# Altium schematic sheet Microcontroller.SchDoc
size A4; SheetNumber: 3; SheetTotal: 3
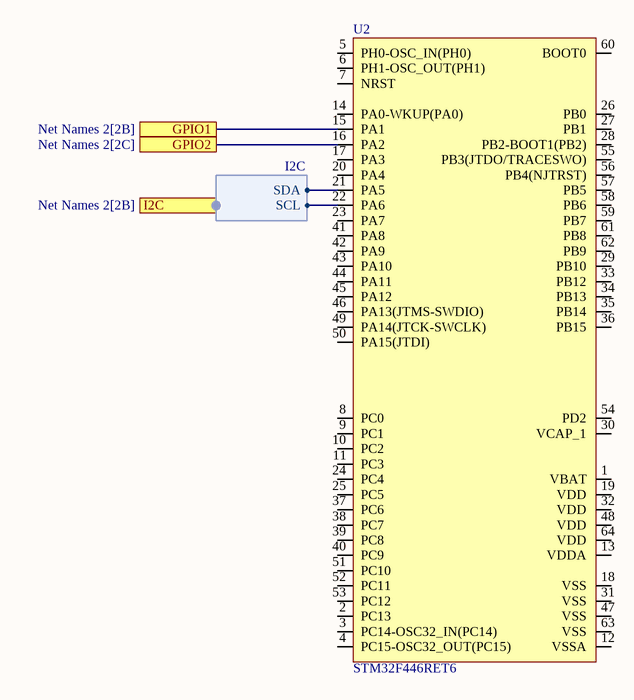
[diagram p0: Microcontroller.SchDoc]

## Parts
U2  STM32F446RET6  [STM_LQFP64_N]

## Ports
GPIO1 (see Net Names 2[2B]), GPIO2 (see Net Names 2[2C]), I2C (harness I2C, see Net Names 2[2B])

## Harnesses
I2C: SDA, SCL

## Nets
GPIO1: U2.15(PA1) ; port GPIO1
GPIO2: U2.16(PA2) ; port GPIO2
NetU2_21: U2.21(PA5) ; port I2C.SDA
NetU2_22: U2.22(PA6) ; port I2C.SCL

Not connected (* = marked no-connect by the designer): U2 1(VBAT) 2(PC13) 3(PC14-OSC32_IN(PC14)) 4(PC15-OSC32_OUT(PC15)) 5(PH0-OSC_IN(PH0)) 6(PH1-OSC_OUT(PH1)) 7(NRST) 8(PC0) 9(PC1) 10(PC2) 11(PC3) 12(VSSA) 13(VDDA) 14(PA0-WKUP(PA0)) 17(PA3) 18(VSS) 19(VDD) 20(PA4) 23(PA7) 24(PC4) 25(PC5) 26(PB0) 27(PB1) 28(PB2-BOOT1(PB2)) 29(PB10) 30(VCAP_1) 31(VSS) 32(VDD) 33(PB12) 34(PB13) 35(PB14) 36(PB15) 37(PC6) 38(PC7) 39(PC8) 40(PC9) 41(PA8) 42(PA9) 43(PA10) 44(PA11) 45(PA12) 46(PA13(JTMS-SWDIO)) 47(VSS) 48(VDD) 49(PA14(JTCK-SWCLK)) 50(PA15(JTDI)) 51(PC10) 52(PC11) 53(PC12) 54(PD2) 55(PB3(JTDO/TRACESWO)) 56(PB4(NJTRST)) 57(PB5) 58(PB6) 59(PB7) 60(BOOT0) 61(PB8) 62(PB9) 63(VSS) 64(VDD)

## Library data of the parts
U2 = STM32F446RET6: IC MCU 32BIT 512KB FLASH 64LQFP; Manufacturer 1: STMicroelectronics; Manufacturer Part Number 1: LF80CDT-TR; Supplier 1: Digi-Key; Supplier Part Number 1: 497-15376-ND